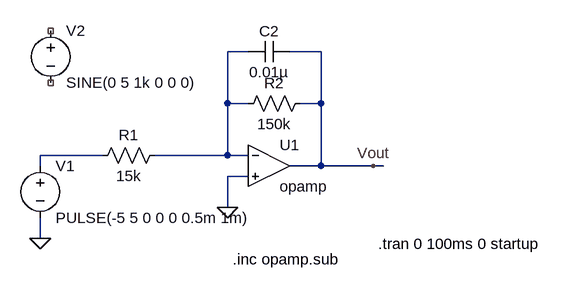
[diagram p0: schematic Demo_Inverting_integrator.asc]
Demo_Inverting_integrator.asc, the LTspice schematic file:
Version 4
SHEET 1 880 680
WIRE 176 -32 144 -32
WIRE 288 -32 240 -32
WIRE 144 48 144 -32
WIRE 176 48 144 48
WIRE 288 48 288 -32
WIRE 288 48 256 48
WIRE -48 128 -144 128
WIRE 144 128 144 48
WIRE 144 128 32 128
WIRE 176 128 144 128
WIRE -144 144 -144 128
WIRE 288 144 288 48
WIRE 288 144 240 144
WIRE 368 144 288 144
WIRE 384 144 368 144
WIRE 176 160 144 160
WIRE 144 208 144 160
WIRE -144 256 -144 224
FLAG -144 256 0
FLAG 144 208 0
FLAG 368 144 Vout
SYMBOL OpAmps\\opamp 208 80 R0
SYMATTR InstName U1
SYMBOL res 48 112 R90
WINDOW 0 0 56 VBottom 2
WINDOW 3 32 56 VTop 2
SYMATTR InstName R1
SYMATTR Value 15k
SYMBOL res 272 32 R90
WINDOW 0 0 56 VBottom 2
WINDOW 3 32 56 VTop 2
SYMATTR InstName R2
SYMATTR Value 150k
SYMBOL cap 240 -48 R90
WINDOW 0 0 32 VBottom 2
WINDOW 3 32 32 VTop 2
SYMATTR InstName C2
SYMATTR Value 0.01µ
SYMBOL voltage -144 128 R0
WINDOW 123 0 0 Left 0
WINDOW 39 0 0 Left 0
SYMATTR InstName V1
SYMATTR Value PULSE(-5 5 0 0 0 0.5m 1m)
SYMBOL voltage -128 -80 R0
WINDOW 123 0 0 Left 0
WINDOW 39 0 0 Left 0
SYMATTR InstName V2
SYMATTR Value SINE(0 5 1k 0 0 0)
TEXT 152 288 Left 2 !.inc opamp.sub
TEXT 376 264 Left 2 !.tran 0 100ms 0 startup

The netlist it stands for:
* Demo_Inverting_integrator.asc
XU1 N001 0 Vout opamp Aol=100K GBW=10Meg  ; pins invin noninvin out
R1 N001 N002 15k
R2 Vout N001 150k
C2 Vout N001 0.01µ
V1 N002 0 PULSE(-5 5 0 0 0 0.5m 1m)
V2 NC_01 NC_02 SINE(0 5 1k 0 0 0)
.inc opamp.sub
.tran 0 100ms 0 startup
.backanno
.end